# Altium schematic sheet Filtre Passe-Haut.SchDoc
size A4; SheetNumber: 1; SheetTotal: 2
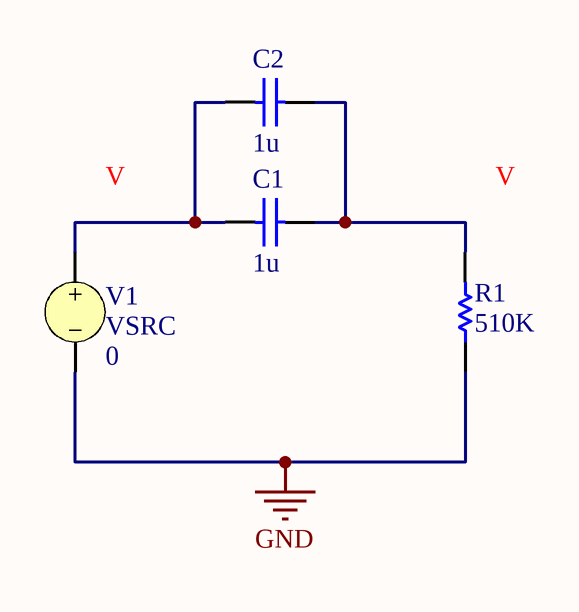
[diagram p0: Filtre Passe-Haut.SchDoc]

## Parts
C1  value 1u  (hidden comment: Capacitor)
C2  value 1u  (hidden comment: Capacitor)
R1  value 510K  (hidden comment: Resistor)
V1  VSRC  DC Magnitude: 0

## Nets
GND: R1.1 V1.2
NetC1_1: C1.1 C2.2 R1.2
NetC1_2: C1.2 C2.1 V1.1

## Library data of the parts
C1 C2 = Capacitor: SimulationGenericComponent: True
R1 = Resistor: TC1: 0; SimulationGenericComponent: True; TC2: 0
V1 = VSRC: Voltage Source; Note: PCB Footprint - Not required; Amplitude: 3; Frequency: 15; Published: 30-July-2020; LatestRevisionDate: 30-July-2020; LatestRevisionNote: Re-released for DXP Platform.; PackageReference: Not Applicable; Publisher: Altium Limited; AC Magnitude: 0; AC Phase: 0; Offset: 0; Delay: 0; Damping Factor: 0; Phase: 0